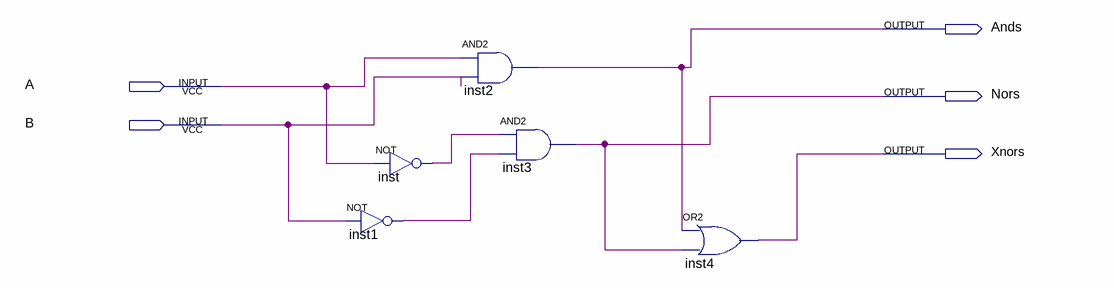
[diagram p0: schematic sheet]
// Quartus schematic compuertas.bdf as structural Verilog: 5 symbols, 5 pins
module compuertas (
  input  A,
  input  B,
  output Ands,
  output Nors,
  output Xnors
);

  wire inst1_out, inst_out;

  not inst (inst_out, A);
  not inst1 (inst1_out, B);
  and inst2 (Ands, A, B);
  and inst3 (Nors, inst_out, inst1_out);
  or inst4 (Xnors, Ands, Nors);
endmodule
